# EAGLE design Max2_FP_v2 (EAGLE 6.6.0)
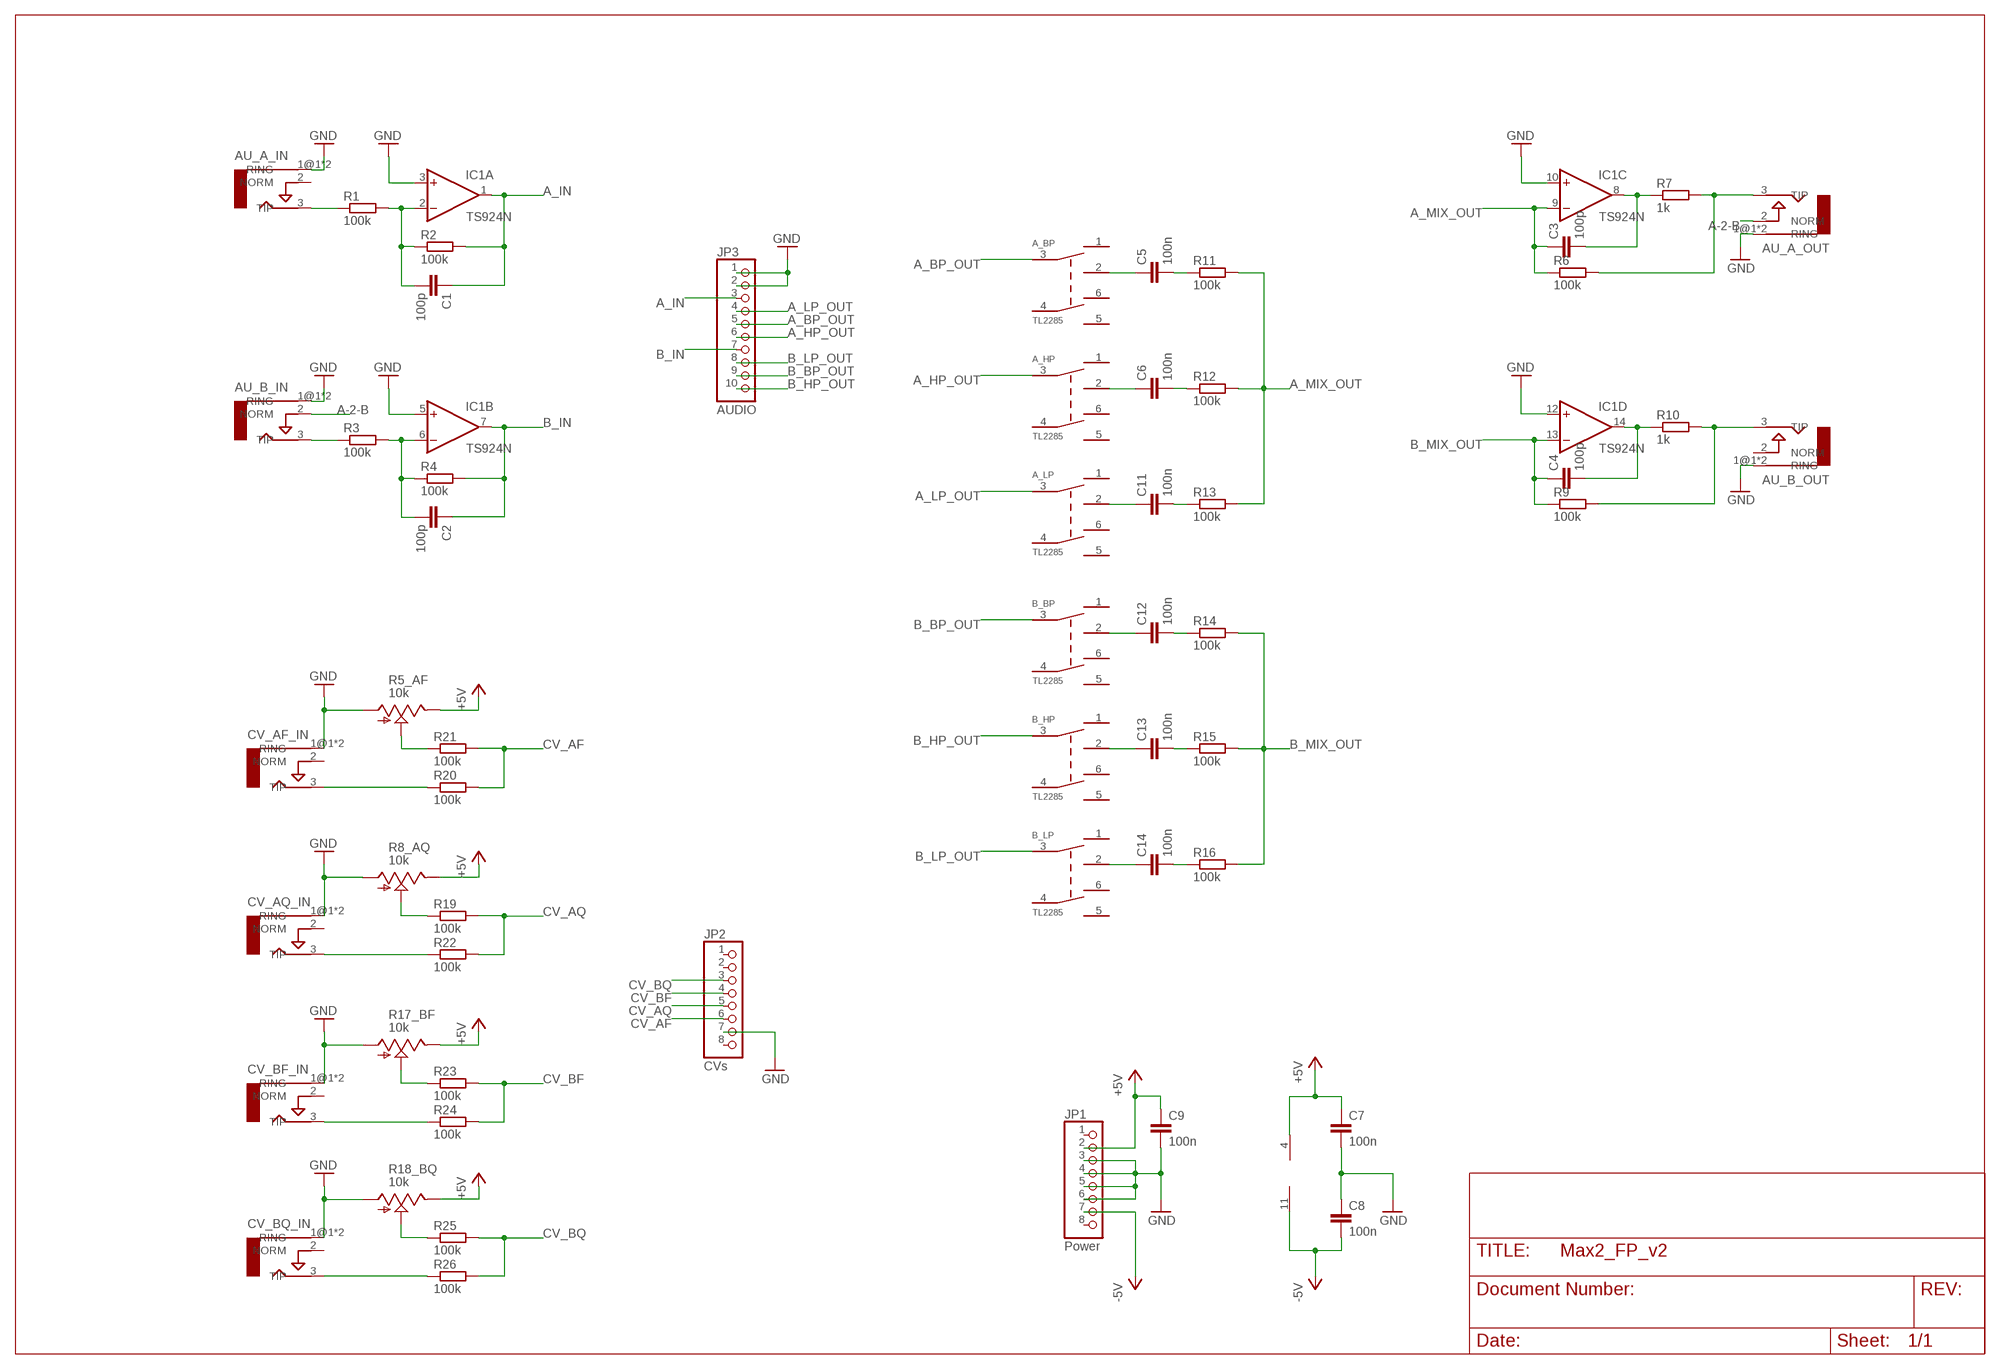
[diagram p0: schematic, sheet 1]

## Parts
A_BP  TL2285  [TL2285_PCB]
A_HP  TL2285  [TL2285_PCB]
A_LP  TL2285  [TL2285_PCB]
AU_A_IN  AUDIO-JACKERTHENVAR  [ERTHENVAR-JACK]
AU_A_OUT  AUDIO-JACKERTHENVAR  [ERTHENVAR-JACK]
AU_B_IN  AUDIO-JACKERTHENVAR  [ERTHENVAR-JACK]
AU_B_OUT  AUDIO-JACKERTHENVAR  [ERTHENVAR-JACK]
B_BP  TL2285  [TL2285_PCB]
B_HP  TL2285  [TL2285_PCB]
B_LP  TL2285  [TL2285_PCB]
C1  100p  C-EU025-025X050  [C025-025X050]
C2  100p  C-EU025-025X050  [C025-025X050]
C3  100p  C-EU025-025X050  [C025-025X050]
C4  100p  C-EU025-025X050  [C025-025X050]
C5  100n  C-EU050-025X075  [C050-025X075]
C6  100n  C-EU050-025X075  [C050-025X075]
C7  100n  C-EU025-025X050  [C025-025X050]
C8  100n  C-EU025-025X050  [C025-025X050]
C9  100n  C-EU025-025X050  [C025-025X050]
C11  100n  C-EU050-025X075  [C050-025X075]
C12  100n  C-EU050-025X075  [C050-025X075]
C13  100n  C-EU050-025X075  [C050-025X075]
C14  100n  C-EU050-025X075  [C050-025X075]
CV_AF_IN  AUDIO-JACKERTHENVAR  [ERTHENVAR-JACK]
CV_AQ_IN  AUDIO-JACKERTHENVAR  [ERTHENVAR-JACK]
CV_BF_IN  AUDIO-JACKERTHENVAR  [ERTHENVAR-JACK]
CV_BQ_IN  AUDIO-JACKERTHENVAR  [ERTHENVAR-JACK]
IC1  TS924N  [DIL14]
JP1  Power  PINHD-1X8  [1X08]
JP2  CVs  PINHD-1X8  [1X08]
JP3  AUDIO  PINHD-1X10  [1X10]
R1  100k  R-EU_0207/2V  [0207/2V]
R2  100k  R-EU_0207/2V  [0207/2V]
R3  100k  R-EU_0207/2V  [0207/2V]
R4  100k  R-EU_0207/2V  [0207/2V]
R5_AF  10k  POT_USVERTICAL  [ALPS_POT_VERTICAL]
R6  100k  R-EU_0207/2V  [0207/2V]
R7  1k  R-EU_0207/2V  [0207/2V]
R8_AQ  10k  POT_USVERTICAL  [ALPS_POT_VERTICAL]
R9  100k  R-EU_0207/2V  [0207/2V]
R10  1k  R-EU_0207/2V  [0207/2V]
R11  100k  R-EU_0207/2V  [0207/2V]
R12  100k  R-EU_0207/2V  [0207/2V]
R13  100k  R-EU_0207/2V  [0207/2V]
R14  100k  R-EU_0207/2V  [0207/2V]
R15  100k  R-EU_0207/2V  [0207/2V]
R16  100k  R-EU_0207/2V  [0207/2V]
R17_BF  10k  POT_USVERTICAL  [ALPS_POT_VERTICAL]
R18_BQ  10k  POT_USVERTICAL  [ALPS_POT_VERTICAL]
R19  100k  R-EU_0207/2V  [0207/2V]
R20  100k  R-EU_0207/2V  [0207/2V]
R21  100k  R-EU_0207/2V  [0207/2V]
R22  100k  R-EU_0207/2V  [0207/2V]
R23  100k  R-EU_0207/2V  [0207/2V]
R24  100k  R-EU_0207/2V  [0207/2V]
R25  100k  R-EU_0207/2V  [0207/2V]
R26  100k  R-EU_0207/2V  [0207/2V]

## Nets
+5V: C7.1 C9.1 IC1.4(V+) JP1.2 R5_AF.P$1(E) R8_AQ.P$1(E) R17_BF.P$1(E) R18_BQ.P$1(E)
-5V: C8.2 IC1.11(V-) JP1.7
A-2-B: AU_A_OUT.2(NORM) AU_B_IN.2(NORM)
A_BP_OUT: A_BP.3 JP3.5
A_HP_OUT: A_HP.3 JP3.6
A_IN: C1.1 IC1.1(A:OUT) JP3.3 R2.2
A_LP_OUT: A_LP.3 JP3.4
A_MIX_OUT: C3.1 IC1.9(C:-IN) R6.1 R11.2 R12.2 R13.2
B_BP_OUT: B_BP.3 JP3.9
B_HP_OUT: B_HP.3 JP3.10
B_IN: C2.1 IC1.7(B:OUT) JP3.7 R4.2
B_LP_OUT: B_LP.3 JP3.8
B_MIX_OUT: C4.1 IC1.13(D:-IN) R9.1 R14.2 R15.2 R16.2
CV_AF: JP2.6 R20.2 R21.2
CV_AQ: JP2.5 R19.2 R22.2
CV_BF: JP2.4 R23.2 R24.2
CV_BQ: JP2.3 R25.2 R26.2
GND: AU_A_IN.1@1(RING) AU_A_IN.1@2(RING) AU_A_OUT.1@1(RING) AU_A_OUT.1@2(RING) AU_B_IN.1@1(RING) AU_B_IN.1@2(RING) AU_B_OUT.1@1(RING) AU_B_OUT.1@2(RING) C7.2 C8.1 C9.2 CV_AF_IN.1@1(RING) CV_AF_IN.1@2(RING) CV_AQ_IN.1@1(RING) CV_AQ_IN.1@2(RING) CV_BF_IN.1@1(RING) CV_BF_IN.1@2(RING) CV_BQ_IN.1@1(RING) CV_BQ_IN.1@2(RING) IC1.3(A:+IN) IC1.5(B:+IN) IC1.10(C:+IN) IC1.12(D:+IN) JP1.3 JP1.4 JP1.5 JP1.6 JP2.7 JP3.1 JP3.2 R5_AF.P$3(A) R8_AQ.P$3(A) R17_BF.P$3(A) R18_BQ.P$3(A)
N$1: A_BP.2 C5.1
N$2: AU_A_IN.3(TIP) R1.1
N$3: C1.2 IC1.2(A:-IN) R1.2 R2.1
N$4: C3.2 IC1.8(C:OUT) R7.1
N$5: AU_A_OUT.3(TIP) R6.2 R7.2
N$6: C5.2 R11.1
N$7: C2.2 IC1.6(B:-IN) R3.2 R4.1
N$8: AU_B_IN.3(TIP) R3.1
N$9: C6.2 R12.1
N$10: A_HP.2 C6.1
N$11: A_LP.2 C11.1
N$12: C11.2 R13.1
N$13: C4.2 IC1.14(D:OUT) R10.1
N$14: AU_B_OUT.3(TIP) R9.2 R10.2
N$15: B_BP.2 C12.1
N$16: R5_AF.P$2(S) R21.1
N$17: C12.2 R14.1
N$18: CV_AF_IN.3(TIP) R20.1
N$19: CV_BQ_IN.3(TIP) R26.1
N$20: B_HP.2 C13.1
N$21: CV_AQ_IN.3(TIP) R22.1
N$22: R8_AQ.P$2(S) R19.1
N$23: R17_BF.P$2(S) R23.1
N$24: C13.2 R15.1
N$25: CV_BF_IN.3(TIP) R24.1
N$26: R18_BQ.P$2(S) R25.1
N$27: B_LP.2 C14.1
N$28: C14.2 R16.1
Unconnected: A_BP.1 A_BP.4 A_BP.5 A_BP.6 A_HP.1 A_HP.4 A_HP.5 A_HP.6 A_LP.1 A_LP.4 A_LP.5 A_LP.6 AU_A_IN.2(NORM) AU_B_OUT.2(NORM) B_BP.1 B_BP.4 B_BP.5 B_BP.6 B_HP.1 B_HP.4 B_HP.5 B_HP.6 B_LP.1 B_LP.4 B_LP.5 B_LP.6 CV_AF_IN.2(NORM) CV_AQ_IN.2(NORM) CV_BF_IN.2(NORM) CV_BQ_IN.2(NORM) JP1.1 JP1.8 JP2.1 JP2.2 JP2.8

## Library data of the parts
A_BP A_HP A_LP B_BP B_HP B_LP = lb_devs:TL2285: E-Switch TL2285 (PCB switch)
AU_A_IN AU_A_OUT AU_B_IN AU_B_OUT CV_AF_IN CV_AQ_IN CV_BF_IN CV_BQ_IN = erthenvar:AUDIO-JACK: Switching Mono 3.5mm Audio Jack from Erthenvar.
C1-C9 C11-C14 = rcl:C-EU: CAPACITOR, European symbol
IC1 = lb_devs:TS924: TS924 R2R OpAmp
JP1 JP2 = pinhead:PINHD-1X8: PIN HEADER
JP3 = pinhead:PINHD-1X10: PIN HEADER
R1-R4 R6 R7 R9-R16 R19-R26 = rcl:R-EU_: RESISTOR, European symbol
R5_AF R8_AQ R17_BF R18_BQ = pot-alps:POT_US

## Board
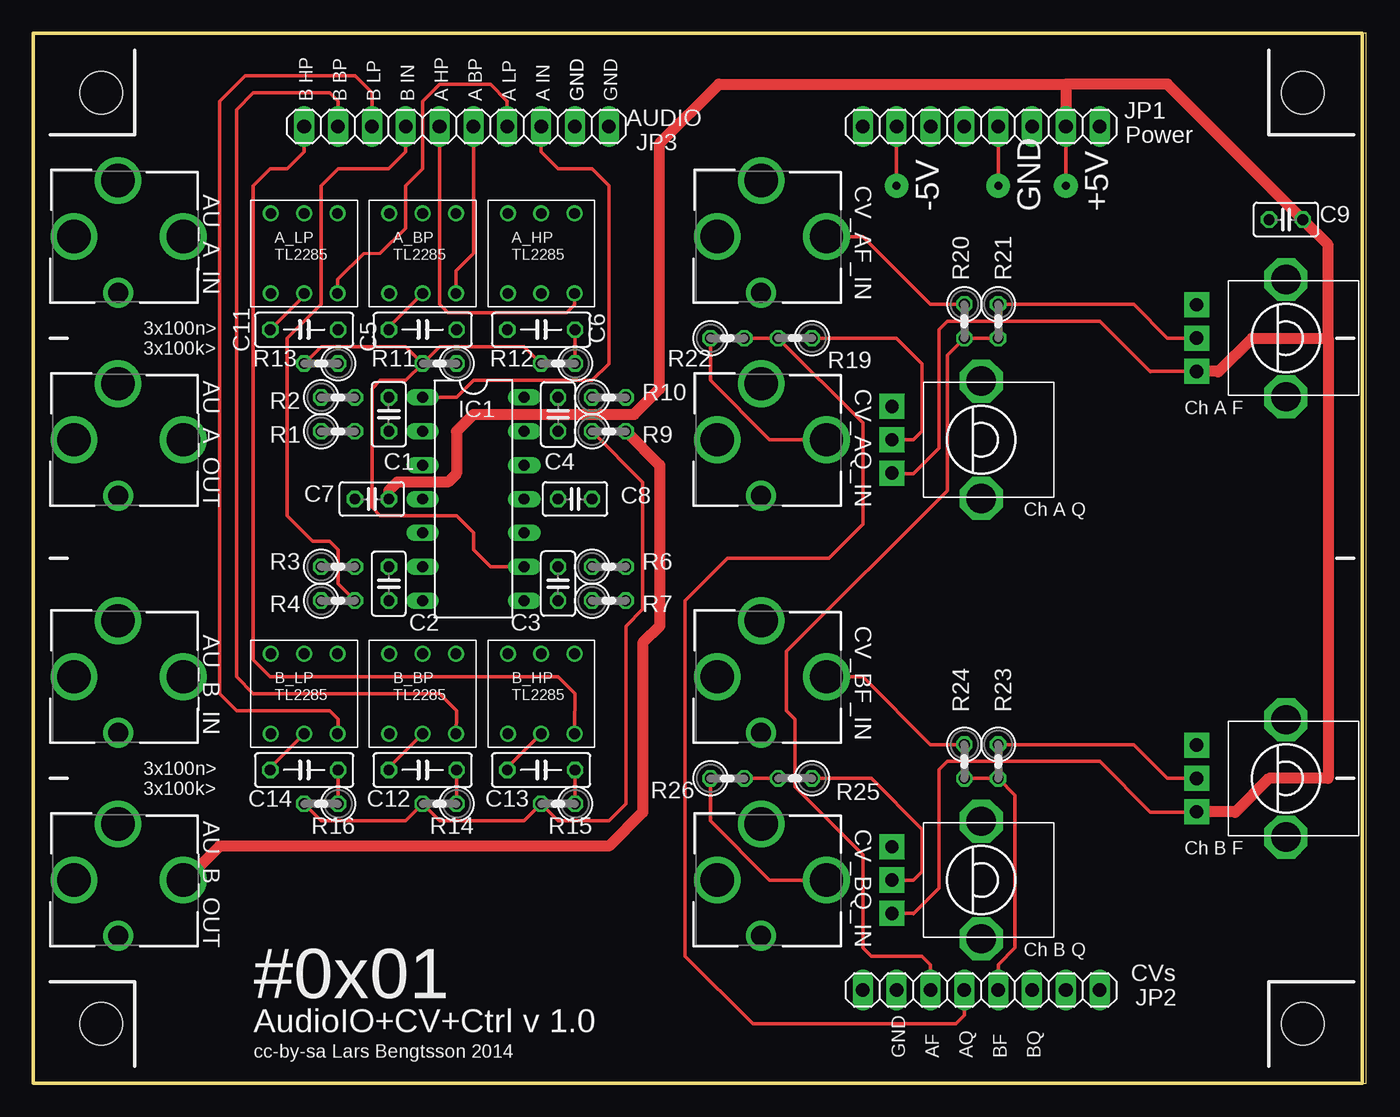
[diagram p1: board, top side]
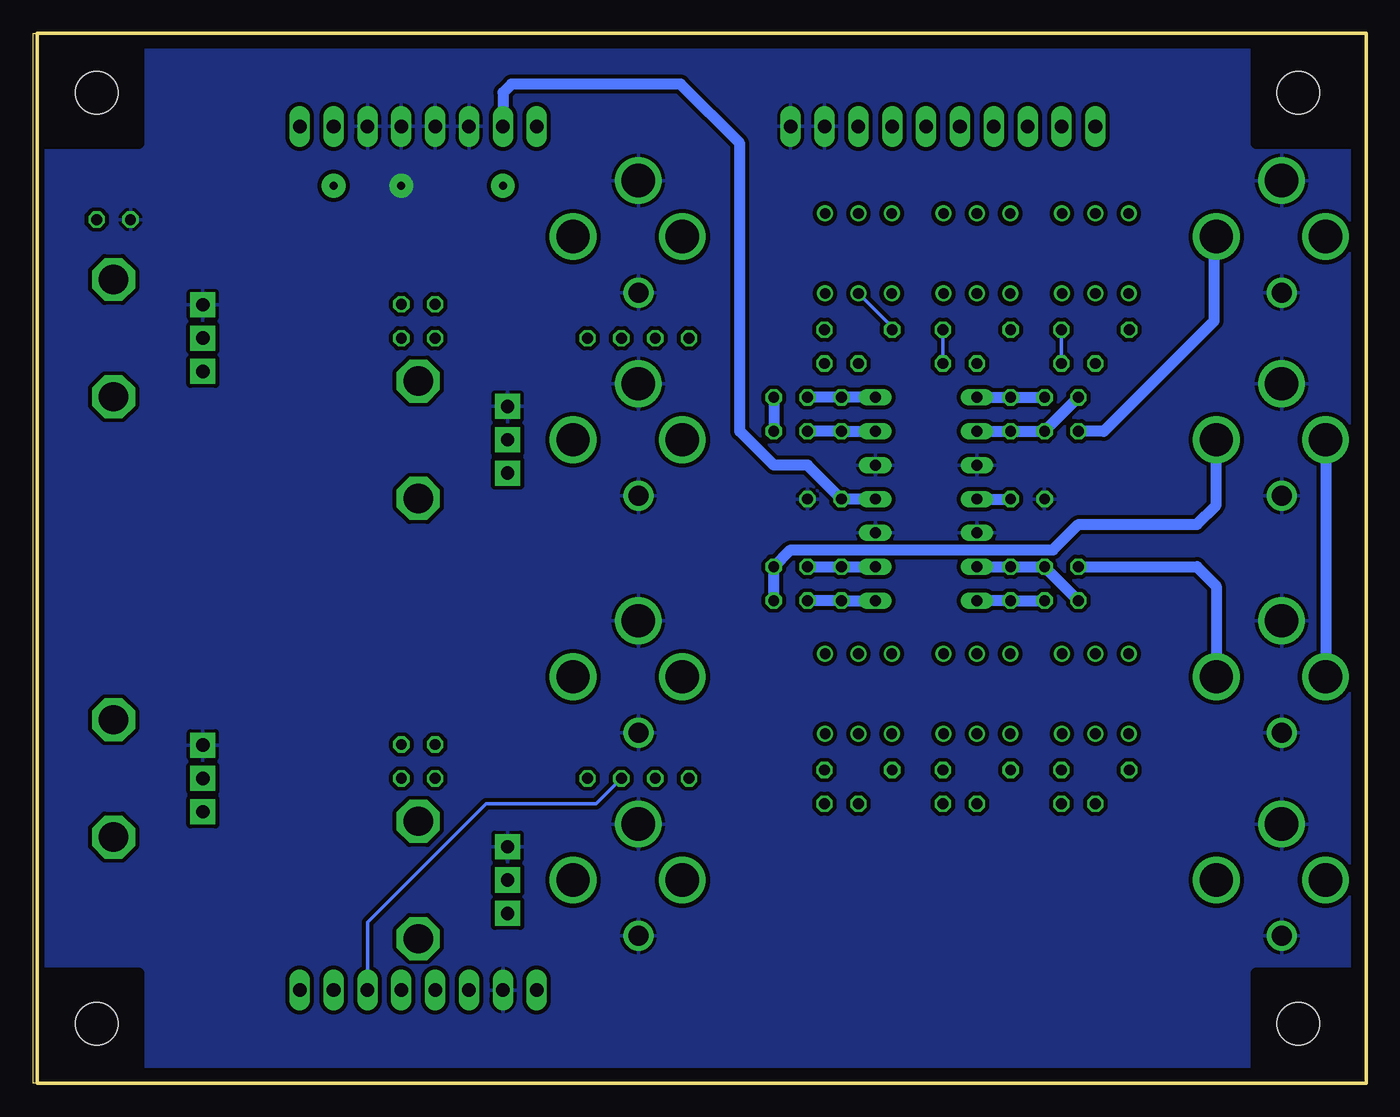
[diagram p2: board, bottom side, seen from below]

Size 100 x 78.74 mm. Coordinates in mm from the lower left corner, seen from the top.
Outline: 99.69,0 100,0 100,78.73 0,78.73 0,0
Outline: 0,0 0,78.74 99.69,78.74 99.69,0
Outline: 0,0 99.69,0
Copper layers (1*16): Top 0.0356mm / dielectric 1.5011mm / Bottom 0.0356mm
Design rules "LaenPCBOrder *": minimum track width 6mil, minimum drill 13mil, track to track 6mil, track to pad 6mil, pad to pad 6mil, via to via 6mil, smd to smd 6mil, copper to edge 15mil, drill to drill 6mil, minimum pad ring 7mil, minimum via ring 7mil, stop-mask expansion 3mil, vias tented up to drill 0mil, thermal gap 10mil
Holes 3.2 mm at 5.08,74.3 95.25,74.3 95.25,4.45 5.08,4.45
bRestrict: 16 lines

### Footprints (pad centres in the part's own frame; a part is rotated, then mirrored left to right if it is on the bottom)
TL2285_PCB = drill 0.8: 1 -2.5,-3; 2 0,-3; 3 2.5,-3; 4 -2.5,3; 5 0,3; 6 2.5,3
ERTHENVAR-JACK = drill 2.5: 1@1 -4.2,0; 2 0,-3.3; 3 0,4.9 | drill 1.5: 1@2 4.2,0
C025-025X050 = drill 0.813 octagon: 1 -1.27,0; 2 1.27,0
C050-025X075 = drill 0.813 octagon: 1 -2.54,0; 2 2.54,0
DIL14 = drill 0.813 long: 1 -7.62,-3.81; 2 -5.08,-3.81; 3 -2.54,-3.81; 4 0,-3.81; 5 2.54,-3.81; 6 5.08,-3.81; 7 7.62,-3.81; 8 7.62,3.81; 9 5.08,3.81; 10 2.54,3.81; 11 0,3.81; 12 -2.54,3.81; 13 -5.08,3.81; 14 -7.62,3.81
1X08 = drill 1.016 long: 1 -8.89,0; 2 -6.35,0; 3 -3.81,0; 4 -1.27,0; 5 1.27,0; 6 3.81,0; 7 6.35,0; 8 8.89,0
1X10 = drill 1.016 long: 1 -11.43,0; 2 -8.89,0; 3 -6.35,0; 4 -3.81,0; 5 -1.27,0; 6 1.27,0; 7 3.81,0; 8 6.35,0; 9 8.89,0; 10 11.43,0
0207/2V = drill 0.813 octagon: 1 -1.27,0; 2 1.27,0
ALPS_POT_VERTICAL = drill 1 pad 1.88 square: P$1 -2.5,6.7; P$2 0,6.7; P$3 2.5,6.7 | drill 2.2 pad 3.175 octagon: P$4 -4.4,0; P$5 4.4,0

### Placement (x,y rotation side)
A_BP  29.21,62.23 0 top
A_HP  38.1,62.23 0 top
A_LP  20.32,62.23 0 top
AU_A_IN  6.35,63.5 270 top
AU_A_OUT  6.35,48.26 270 top
AU_B_IN  6.35,30.48 270 top
AU_B_OUT  6.35,15.24 270 top
B_BP  29.21,29.21 0 top
B_HP  38.1,29.21 0 top
B_LP  20.32,29.21 0 top
C1  26.67,50.16 270 top
C2  26.67,37.47 90 top
C3  39.37,37.47 270 top
C4  39.37,50.16 90 top
C5  29.21,56.52 0 top
C6  38.1,56.52 0 top
C7  25.4,43.81 180 top
C8  40.64,43.81 180 top
C9  93.98,64.77 180 top
C11  20.32,56.52 0 top
C12  29.21,23.5 0 top
C13  38.1,23.5 0 top
C14  20.32,23.5 0 top
CV_AF_IN  54.61,63.5 270 top
CV_AQ_IN  54.61,48.26 270 top
CV_BF_IN  54.61,30.48 270 top
CV_BQ_IN  54.61,15.24 270 top
IC1  33.02,43.81 270 top
JP1  71.12,71.75 180 top
JP2  71.12,6.99 180 top
JP3  31.75,71.75 180 top
R1  22.86,48.9 0 top
R2  22.86,51.44 0 top
R3  22.86,38.73 0 top
R4  22.86,36.2 0 top
R5_AF  93.98,55.88 90 top
R6  43.18,38.73 0 top
R7  43.18,36.2 0 top
R8_AQ  71.12,48.26 90 top
R9  43.18,48.9 0 top
R10  43.18,51.44 0 top
R11  30.48,53.98 180 top
R12  39.37,53.98 180 top
R13  21.59,53.98 180 top
R14  30.48,20.95 180 top
R15  39.37,20.95 180 top
R16  21.59,20.95 180 top
R17_BF  93.98,22.86 90 top
R18_BQ  71.12,15.24 90 top
R19  57.15,55.88 180 top
R20  69.85,57.15 270 top
R21  72.39,57.15 270 top
R22  52.07,55.88 0 top
R23  72.39,24.13 270 top
R24  69.85,24.13 270 top
R25  57.15,22.86 180 top
R26  52.07,22.86 0 top

### Tracks (layer width: path | path; a pad name or v marks a point on that pad's centre or on a via)
+5V  (via drill 0.6 pad 1.78)
  Top 0.254: R8_AQ.P$1 64.46,45.72 66.04,45.72 67.94,47.62 67.94,56.52 68.58,57.15 80.01,57.15 83.82,53.34 83.86,53.38 R5_AF.P$1 | R17_BF.P$1 87.24,20.32 83.82,20.32 80.01,24.13 68.58,24.13 67.94,23.5 67.94,14.61 66.04,12.7 66,12.74 R18_BQ.P$1 | v77.47,67.31 JP1.2
  Top 0.813: 97.16,55.88 97.16,22.86 92.71,22.86 90.17,20.32 90.13,20.36 R17_BF.P$1 | 77.47,74.93 51.44,74.93 46.99,70.48 46.99,52.07 45.09,50.16 33.02,50.16 31.75,48.9 31.75,45.72 31.11,45.09 27.3,45.09 26.67,44.45 C7.1 | 97.16,55.88 91.44,55.88 88.9,53.34 88.86,53.38 R5_AF.P$1 | 97.16,55.88 97.16,62.87 C9.1 85.09,74.93 77.47,74.93 | 77.47,74.93 JP1.2
  Bottom 0.813: IC1.4 C7.1
-5V  (via drill 0.6 pad 1.78)
  Top 0.254: v64.77,67.31 JP1.7
  Bottom 0.813: IC1.11 C8.2 41.91,46.35 44.45,46.35 46.99,48.9 46.99,70.48 51.44,74.93 64.14,74.93 64.77,74.3 JP1.7
A-2-B
  Bottom 0.813: AU_A_OUT.2 AU_B_IN.2
A_BP_OUT
  Top 0.254: JP3.5 33.02,62.23 31.71,60.92 A_BP.3
A_HP_OUT
  Top 0.254: JP3.6 30.48,58.42 31.11,57.78 40.01,57.78 40.6,58.38 A_HP.3
A_IN
  Top 0.254: JP3.3 38.1,69.85 39.37,68.58 41.91,68.58 43.18,67.31 43.18,53.98 41.91,52.7 33.02,52.7 31.75,51.44 IC1.1
  Bottom 0.813: IC1.1 C1.1 R2.2
A_LP_OUT
  Top 0.254: JP3.4 35.56,73.66 34.29,74.93 30.48,74.93 29.21,73.66 29.21,68.58 27.94,67.31 27.94,64.14 26.04,62.23 24.77,62.19 22.82,60.28 A_LP.3
A_MIX_OUT
  Top 0.254: IC1.9 34.29,38.73 33.02,40.01 33.02,41.27 31.75,42.55 26.04,42.55 25.4,43.18 25.4,52.07 26.04,52.7 27.94,52.7 R11.2 | R13.2 21.59,55.24 27.94,55.24 R11.2 | R12.2 36.83,55.24 30.48,55.24 R11.2
  Bottom 0.813: IC1.9 C3.1 R6.1
B_BP_OUT
  Top 0.254: JP3.9 22.86,73.66 22.23,74.3 16.51,74.3 15.24,73.03 15.24,30.48 16.51,29.21 30.48,29.21 31.75,27.94 31.71,26 B_BP.3
B_HP_OUT
  Top 0.254: JP3.10 20.32,69.85 19.05,68.58 17.78,68.58 16.51,67.31 16.51,31.75 17.78,30.48 39.37,30.48 40.64,29.21 40.6,26.63 B_HP.3
B_IN
  Top 0.254: JP3.7 27.94,69.85 26.67,68.58 22.86,68.58 21.59,67.31 21.59,58.42 19.05,55.88 19.05,42.55 20.95,40.64 22.23,40.64 22.86,40.01 22.86,37.47 R4.2
  Bottom 0.813: IC1.7 C2.1 R4.2
B_LP_OUT
  Top 0.254: B_LP.3 22.86,26.25 22.86,27.3 22.23,27.94 15.24,27.94 13.97,29.21 13.97,73.66 15.88,75.56 24.13,75.56 25.4,74.3 JP3.8
B_MIX_OUT
  Top 0.254: R16.2 21.59,19.68 27.94,19.68 R14.2 30.48,19.68 36.83,19.68 R15.2 39.37,19.68 43.18,19.68 44.45,20.95 44.45,34.29 45.72,35.56 45.72,45.09 R9.1
  Bottom 0.813: IC1.13 C4.1 R9.1
CV_AF
  Top 0.254: R21.2 R20.2 68.58,54.61 68.58,44.45 56.52,32.38 56.52,27.94 57.15,27.3 57.15,22.23 62.23,17.14 62.23,10.16 62.87,9.53 66.67,9.53 67.31,8.89 JP2.6
CV_AQ
  Top 0.254: R22.2 R19.2 62.23,49.53 62.23,41.91 59.69,39.37 52.07,39.37 48.9,36.2 48.9,9.53 53.98,4.45 69.22,4.45 69.85,5.08 JP2.5
CV_BF
  Top 0.254: R24.2 R23.2 73.66,21.59 73.66,10.16 72.39,8.89 JP2.4
CV_BQ
  Top 0.254: R26.2 R25.2
  Bottom 0.254: JP2.3 74.93,12.06 66.04,20.95 57.78,20.95 R25.2
GND  (via drill 0.6 pad 1.78)
  Top 0.254: v72.39,67.31 JP1.4
  pour Bottom (isolate 0.305): 1.27,77.47 1.27,1.27 99.06,1.27 99.06,77.47
N$1
  Top 0.254: A_BP.2 26.67,56.69 C5.1
N$2
  Bottom 0.813: AU_A_IN.3 11.43,63.32 11.43,57.15 19.68,48.9 R1.1
N$3
  Bottom 0.813: IC1.2 C1.2 R1.2 R2.1
N$4
  Bottom 0.813: IC1.8 C3.2 R7.1
N$5
  Bottom 0.813: R7.2 R6.2 43.18,40.01 23.5,40.01 21.59,41.91 12.7,41.91 11.25,43.36 AU_A_OUT.3
N$6
  Bottom 0.254: C5.2 R11.1
N$7
  Bottom 0.813: IC1.6 C2.2 R3.2 R4.1
N$8
  Bottom 0.813: R3.1 12.7,38.73 11.25,37.28 AU_B_IN.3
N$9
  Top 0.254: C6.2 R12.1
N$10
  Bottom 0.254: A_HP.2 35.56,56.69 C6.1
N$11
  Top 0.254: C11.1 20.32,59.05 A_LP.2
N$12
  Bottom 0.254: C11.2 R13.1
N$13
  Bottom 0.813: IC1.14 C4.2 R10.1
N$14
  Top 0.813: R9.2 46.99,46.35 46.99,34.29 45.72,33.02 45.72,20.32 43.18,17.78 13.97,17.78 11.43,15.24 AU_B_OUT.3
  Bottom 0.813: R10.2 R9.2
N$15
  Top 0.254: B_BP.2 26.67,23.67 C12.1
N$16
  Top 0.254: R21.1 82.55,58.42 85.09,55.88 R5_AF.P$2
N$17
  Top 0.254: C12.2 R14.1
N$18
  Top 0.254: CV_AF_IN.3 62.23,63.5 67.31,58.42 R20.1
N$19
  Top 0.254: CV_BQ_IN.3 55.24,15.24 50.8,19.68 R26.1
N$20
  Top 0.254: B_HP.2 35.56,23.67 C13.1
N$21
  Top 0.254: CV_AQ_IN.3 55.24,48.26 50.8,52.7 R22.1
N$22
  Top 0.254: R19.1 64.77,55.88 66.67,53.98 66.67,48.9 66.04,48.26 R8_AQ.P$2
N$23
  Top 0.254: R23.1 82.55,25.4 85.09,22.86 R17_BF.P$2
N$24
  Top 0.254: C13.2 R15.1
N$25
  Top 0.254: CV_BF_IN.3 62.23,30.48 67.31,25.4 R24.1
N$26
  Top 0.254: R18_BQ.P$2 66.04,15.24 66.67,15.88 66.67,19.05 62.87,22.86 R25.1
N$27
  Top 0.254: B_LP.2 17.78,23.67 C14.1
N$28
  Top 0.254: C14.2 R16.1

### Text on the board
tPlace: B HP | B BP | B LP | B IN | A HP | A BP | A LP | A IN | GND | GND | GND | -5V | GND | +5V | 3x100n> / 3x100k> | Ch A F | Ch A Q | 3x100n> / 3x100k> | Ch B F | Ch B Q | #0x01 | AudioIO+CV+Ctrl v 1.0 | cc-by-sa Lars Bengtsson 2014 | GND | AF | AQ | BF | BQ